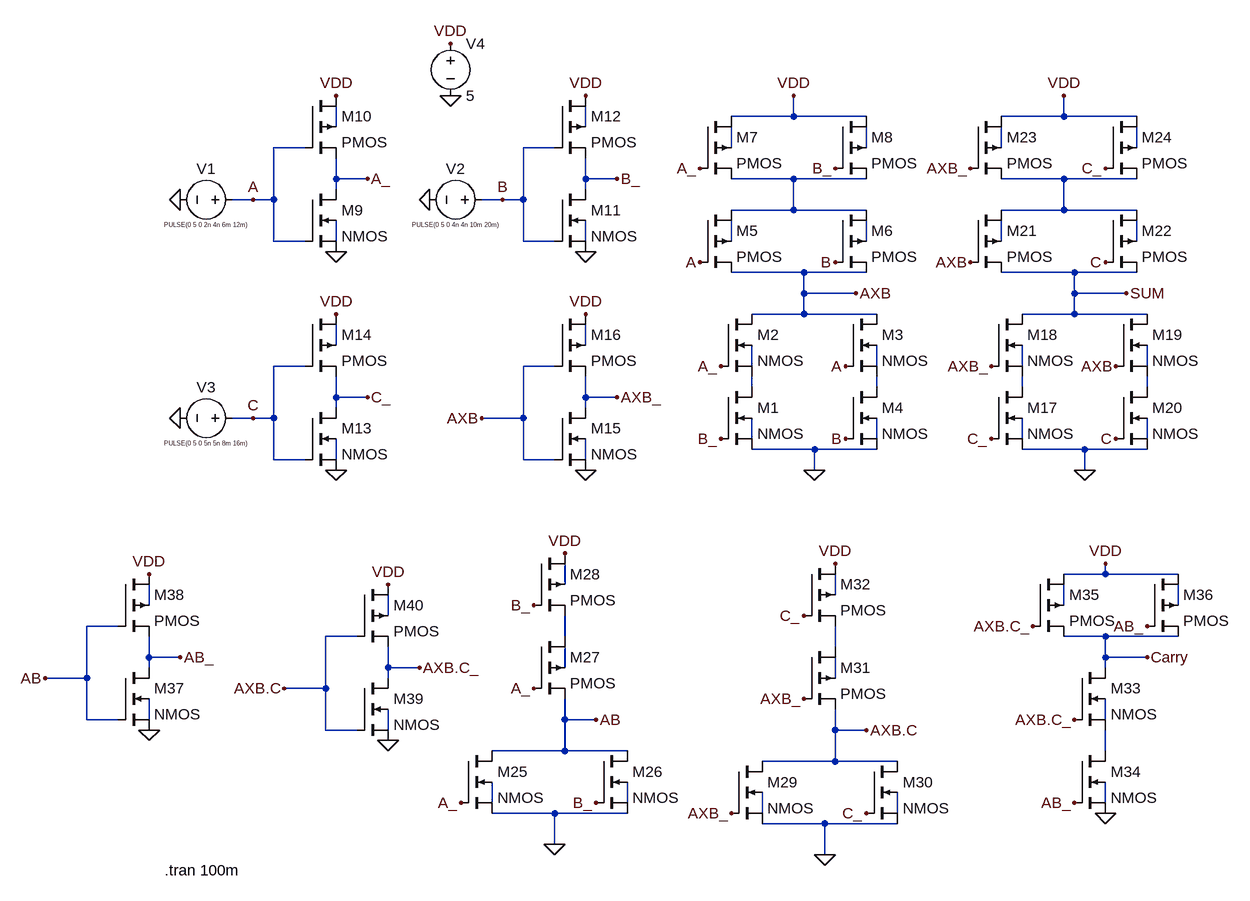
[diagram p0: schematic CMOS_Full_Adder.asc]
CMOS_Full_Adder.asc, the LTspice schematic file:
Version 4
SHEET 1 2176 936
WIRE 128 -240 128 -272
WIRE 128 -240 32 -240
WIRE 240 -240 128 -240
WIRE 544 -240 544 -272
WIRE 544 -240 448 -240
WIRE 656 -240 544 -240
WIRE -576 -224 -576 -256
WIRE -192 -224 -192 -256
WIRE -624 -192 -672 -192
WIRE -240 -192 -288 -192
WIRE 32 -192 32 -224
WIRE 240 -192 240 -224
WIRE 448 -192 448 -224
WIRE 656 -192 656 -224
WIRE -576 -144 -576 -176
WIRE -528 -144 -576 -144
WIRE -192 -144 -192 -176
WIRE -144 -144 -192 -144
WIRE 128 -144 32 -144
WIRE 240 -144 128 -144
WIRE 544 -144 448 -144
WIRE 656 -144 544 -144
WIRE -576 -128 -576 -144
WIRE -192 -128 -192 -144
WIRE -704 -112 -736 -112
WIRE -672 -112 -672 -192
WIRE -672 -112 -704 -112
WIRE -320 -112 -352 -112
WIRE -288 -112 -288 -192
WIRE -288 -112 -320 -112
WIRE 128 -96 128 -144
WIRE 128 -96 32 -96
WIRE 240 -96 128 -96
WIRE 544 -96 544 -144
WIRE 544 -96 448 -96
WIRE 656 -96 544 -96
WIRE -672 -48 -672 -112
WIRE -624 -48 -672 -48
WIRE -576 -48 -576 -80
WIRE -288 -48 -288 -112
WIRE -240 -48 -288 -48
WIRE -192 -48 -192 -80
WIRE 32 -48 32 -80
WIRE 240 -48 240 -80
WIRE 448 -48 448 -80
WIRE 656 -48 656 -80
WIRE 144 0 32 0
WIRE 240 0 144 0
WIRE 560 0 448 0
WIRE 656 0 560 0
WIRE 144 32 144 0
WIRE 224 32 144 32
WIRE 560 32 560 0
WIRE 640 32 560 32
WIRE 144 64 144 32
WIRE 144 64 64 64
WIRE 256 64 144 64
WIRE 560 64 560 32
WIRE 560 64 480 64
WIRE 672 64 560 64
WIRE -576 112 -576 80
WIRE -192 112 -192 80
WIRE -624 144 -672 144
WIRE -240 144 -288 144
WIRE 64 144 64 112
WIRE 256 144 256 112
WIRE 480 144 480 112
WIRE 672 144 672 112
WIRE 64 176 64 160
WIRE 256 176 256 160
WIRE 480 176 480 160
WIRE 672 176 672 160
WIRE -576 192 -576 160
WIRE -528 192 -576 192
WIRE -192 192 -192 160
WIRE -144 192 -192 192
WIRE -576 208 -576 192
WIRE -192 208 -192 192
WIRE -704 224 -736 224
WIRE -672 224 -672 144
WIRE -672 224 -704 224
WIRE -288 224 -288 144
WIRE -288 224 -352 224
WIRE 64 256 64 224
WIRE 256 256 256 224
WIRE 480 256 480 224
WIRE 672 256 672 224
WIRE 160 272 64 272
WIRE 256 272 160 272
WIRE 576 272 480 272
WIRE 672 272 576 272
WIRE -672 288 -672 224
WIRE -624 288 -672 288
WIRE -576 288 -576 256
WIRE -288 288 -288 224
WIRE -240 288 -288 288
WIRE -192 288 -192 256
WIRE 160 304 160 272
WIRE 576 304 576 272
WIRE 608 464 608 448
WIRE 608 464 544 464
WIRE 720 464 608 464
WIRE -224 480 -224 448
WIRE 192 496 192 464
WIRE -864 512 -864 480
WIRE 544 512 544 480
WIRE 720 512 720 480
WIRE -496 528 -496 496
WIRE -912 544 -960 544
WIRE -544 560 -592 560
WIRE -224 560 -224 528
WIRE 608 560 544 560
WIRE 720 560 608 560
WIRE 192 576 192 544
WIRE -864 592 -864 560
WIRE -816 592 -864 592
WIRE 608 592 608 560
WIRE 672 592 608 592
WIRE -864 608 -864 592
WIRE -496 608 -496 576
WIRE -448 608 -496 608
WIRE -224 608 -224 576
WIRE 608 608 608 592
WIRE -960 624 -960 544
WIRE -960 624 -1024 624
WIRE -496 624 -496 608
WIRE 192 624 192 592
WIRE -592 640 -592 560
WIRE -592 640 -656 640
WIRE -960 688 -960 624
WIRE -912 688 -960 688
WIRE -864 688 -864 656
WIRE -224 688 -224 656
WIRE -176 688 -224 688
WIRE 608 688 608 656
WIRE -592 704 -592 640
WIRE -544 704 -592 704
WIRE -496 704 -496 672
WIRE 192 704 192 672
WIRE 240 704 192 704
WIRE -224 736 -224 688
WIRE -224 736 -336 736
WIRE -128 736 -224 736
WIRE 608 736 608 704
WIRE 192 752 192 704
WIRE 192 752 80 752
WIRE 288 752 192 752
WIRE -336 816 -336 784
WIRE -128 816 -128 784
WIRE 608 816 608 784
WIRE -240 832 -336 832
WIRE -128 832 -240 832
WIRE 80 832 80 800
WIRE 288 832 288 800
WIRE 176 848 80 848
WIRE 288 848 176 848
WIRE -240 880 -240 832
WIRE 176 896 176 848
FLAG 16 144 A_
FLAG 16 256 B_
FLAG 208 144 A
FLAG 208 256 B
FLAG 160 304 0
FLAG -16 -16 A
FLAG 192 -16 B
FLAG -16 -160 A_
FLAG 192 -160 B_
FLAG 128 -272 VDD
FLAG 224 32 AXB
FLAG -576 -32 0
FLAG -576 -272 VDD
FLAG -528 -144 A_
FLAG -704 -112 A
FLAG -816 -112 0
FLAG -192 -32 0
FLAG -192 -272 VDD
FLAG -144 -144 B_
FLAG -320 -112 B
FLAG -432 -112 0
FLAG -576 304 0
FLAG -576 64 VDD
FLAG -528 192 C_
FLAG -704 224 C
FLAG -816 224 0
FLAG -192 304 0
FLAG -192 64 VDD
FLAG -144 192 AXB_
FLAG -352 224 AXB
FLAG -400 -272 0
FLAG -400 -352 VDD
FLAG -384 816 A_
FLAG -176 816 B_
FLAG -272 640 A_
FLAG -272 512 B_
FLAG -224 432 VDD
FLAG -176 688 AB
FLAG -240 880 0
FLAG 32 832 AXB_
FLAG 240 832 C_
FLAG 144 656 AXB_
FLAG 144 528 C_
FLAG 192 448 VDD
FLAG 240 704 AXB.C
FLAG 176 896 0
FLAG 608 832 0
FLAG 560 816 AB_
FLAG 560 688 AXB.C_
FLAG 608 448 VDD
FLAG 672 544 AB_
FLAG 496 544 AXB.C_
FLAG 672 592 Carry
FLAG 432 256 C_
FLAG 624 144 AXB
FLAG 624 256 C
FLAG 576 304 0
FLAG 400 -16 AXB
FLAG 608 -16 C
FLAG 400 -160 AXB_
FLAG 608 -160 C_
FLAG 544 -272 VDD
FLAG 640 32 SUM
FLAG 432 144 AXB_
FLAG -864 704 0
FLAG -864 464 VDD
FLAG -496 720 0
FLAG -496 480 VDD
FLAG -1024 624 AB
FLAG -816 592 AB_
FLAG -656 640 AXB.C
FLAG -448 608 AXB.C_
SYMBOL nmos4 16 176 R0
SYMATTR InstName M1
SYMBOL nmos4 16 64 R0
SYMATTR InstName M2
SYMBOL nmos4 208 64 R0
SYMATTR InstName M3
SYMBOL nmos4 208 176 R0
SYMATTR InstName M4
SYMBOL pmos4 -16 -96 R0
SYMATTR InstName M5
SYMBOL pmos4 192 -96 R0
SYMATTR InstName M6
SYMBOL pmos4 -16 -240 R0
SYMATTR InstName M7
SYMBOL pmos4 192 -240 R0
SYMATTR InstName M8
SYMBOL nmos4 -624 -128 R0
SYMATTR InstName M9
SYMBOL pmos4 -624 -272 R0
SYMATTR InstName M10
SYMBOL voltage -720 -112 R90
WINDOW 0 -32 56 VBottom 2
WINDOW 3 32 56 VTop 0
WINDOW 123 0 0 Left 0
WINDOW 39 0 0 Left 0
SYMATTR InstName V1
SYMATTR Value PULSE(0 5 0 2n 4n 6m 12m)
SYMBOL nmos4 -240 -128 R0
SYMATTR InstName M11
SYMBOL pmos4 -240 -272 R0
SYMATTR InstName M12
SYMBOL voltage -336 -112 R90
WINDOW 0 -32 56 VBottom 2
WINDOW 3 32 56 VTop 0
WINDOW 123 0 0 Left 0
WINDOW 39 0 0 Left 0
SYMATTR InstName V2
SYMATTR Value PULSE(0 5 0 4n 4n 10m 20m)
SYMBOL nmos4 -624 208 R0
SYMATTR InstName M13
SYMBOL pmos4 -624 64 R0
SYMATTR InstName M14
SYMBOL voltage -720 224 R90
WINDOW 0 -32 56 VBottom 2
WINDOW 3 32 56 VTop 0
WINDOW 123 0 0 Left 0
WINDOW 39 0 0 Left 0
SYMATTR InstName V3
SYMATTR Value PULSE(0 5 0 5n 5n 8m 16m)
SYMBOL nmos4 -240 208 R0
SYMATTR InstName M15
SYMBOL pmos4 -240 64 R0
SYMATTR InstName M16
SYMBOL voltage -400 -368 R0
WINDOW 123 0 0 Left 0
WINDOW 39 0 0 Left 0
SYMATTR InstName V4
SYMATTR Value 5
SYMBOL nmos4 -384 736 R0
SYMATTR InstName M25
SYMBOL nmos4 -176 736 R0
SYMATTR InstName M26
SYMBOL pmos4 -272 560 R0
SYMATTR InstName M27
SYMBOL pmos4 -272 432 R0
SYMATTR InstName M28
SYMBOL nmos4 32 752 R0
SYMATTR InstName M29
SYMBOL nmos4 240 752 R0
SYMATTR InstName M30
SYMBOL pmos4 144 576 R0
SYMATTR InstName M31
SYMBOL pmos4 144 448 R0
SYMATTR InstName M32
SYMBOL nmos4 560 608 R0
SYMATTR InstName M33
SYMBOL nmos4 560 736 R0
SYMATTR InstName M34
SYMBOL pmos4 496 464 R0
SYMATTR InstName M35
SYMBOL pmos4 672 464 R0
SYMATTR InstName M36
SYMBOL nmos4 432 176 R0
SYMATTR InstName M17
SYMBOL nmos4 432 64 R0
SYMATTR InstName M18
SYMBOL nmos4 624 64 R0
SYMATTR InstName M19
SYMBOL nmos4 624 176 R0
SYMATTR InstName M20
SYMBOL pmos4 400 -96 R0
SYMATTR InstName M21
SYMBOL pmos4 608 -96 R0
SYMATTR InstName M22
SYMBOL pmos4 400 -240 R0
SYMATTR InstName M23
SYMBOL pmos4 608 -240 R0
SYMATTR InstName M24
SYMBOL nmos4 -912 608 R0
SYMATTR InstName M37
SYMBOL pmos4 -912 464 R0
SYMATTR InstName M38
SYMBOL nmos4 -544 624 R0
SYMATTR InstName M39
SYMBOL pmos4 -544 480 R0
SYMATTR InstName M40
TEXT -840 920 Left 2 !.tran 100m

The netlist it stands for:
* CMOS_Full_Adder.asc
M1 N021 B_ 0 N025 NMOS
M2 AXB A_ N021 N017 NMOS
M3 AXB A N022 N018 NMOS
M4 N022 B 0 N026 NMOS
M5 N007 A AXB N011 PMOS
M6 N007 B AXB N012 PMOS
M7 VDD A_ N007 N003 PMOS
M8 VDD B_ N007 N004 PMOS
M9 A_ A 0 N009 NMOS
M10 VDD A A_ N001 PMOS
V1 A 0 PULSE(0 5 0 2n 4n 6m 12m)
M11 B_ B 0 N010 NMOS
M12 VDD B B_ N002 PMOS
V2 B 0 PULSE(0 5 0 4n 4n 10m 20m)
M13 C_ C 0 N029 NMOS
M14 VDD C C_ N015 PMOS
V3 C 0 PULSE(0 5 0 5n 5n 8m 16m)
M15 AXB_ AXB 0 N030 NMOS
M16 VDD AXB AXB_ N016 PMOS
V4 VDD 0 5
M25 AB A_ 0 N045 NMOS
M26 AB B_ 0 N046 NMOS
M27 N037 A_ AB N039 PMOS
M28 VDD B_ N037 N031 PMOS
M29 AXB.C AXB_ 0 N048 NMOS
M30 AXB.C C_ 0 N049 NMOS
M31 N038 AXB_ AXB.C N040 PMOS
M32 VDD C_ N038 N032 PMOS
M33 Carry AXB.C_ N044 N042 NMOS
M34 N044 AB_ 0 N047 NMOS
M35 VDD AXB.C_ Carry N034 PMOS
M36 VDD AB_ Carry N035 PMOS
M17 N023 C_ 0 N027 NMOS
M18 SUM AXB_ N023 N019 NMOS
M19 SUM AXB N024 N020 NMOS
M20 N024 C 0 N028 NMOS
M21 N008 AXB SUM N013 PMOS
M22 N008 C SUM N014 PMOS
M23 VDD AXB_ N008 N005 PMOS
M24 VDD C_ N008 N006 PMOS
M37 AB_ AB 0 N041 NMOS
M38 VDD AB AB_ N033 PMOS
M39 AXB.C_ AXB.C 0 N043 NMOS
M40 VDD AXB.C AXB.C_ N036 PMOS
.model NMOS NMOS
.model PMOS PMOS
.lib standard.mos
.tran 100m
.backanno
.end